# EAGLE schematic thermostat (EAGLE 8.0.0)
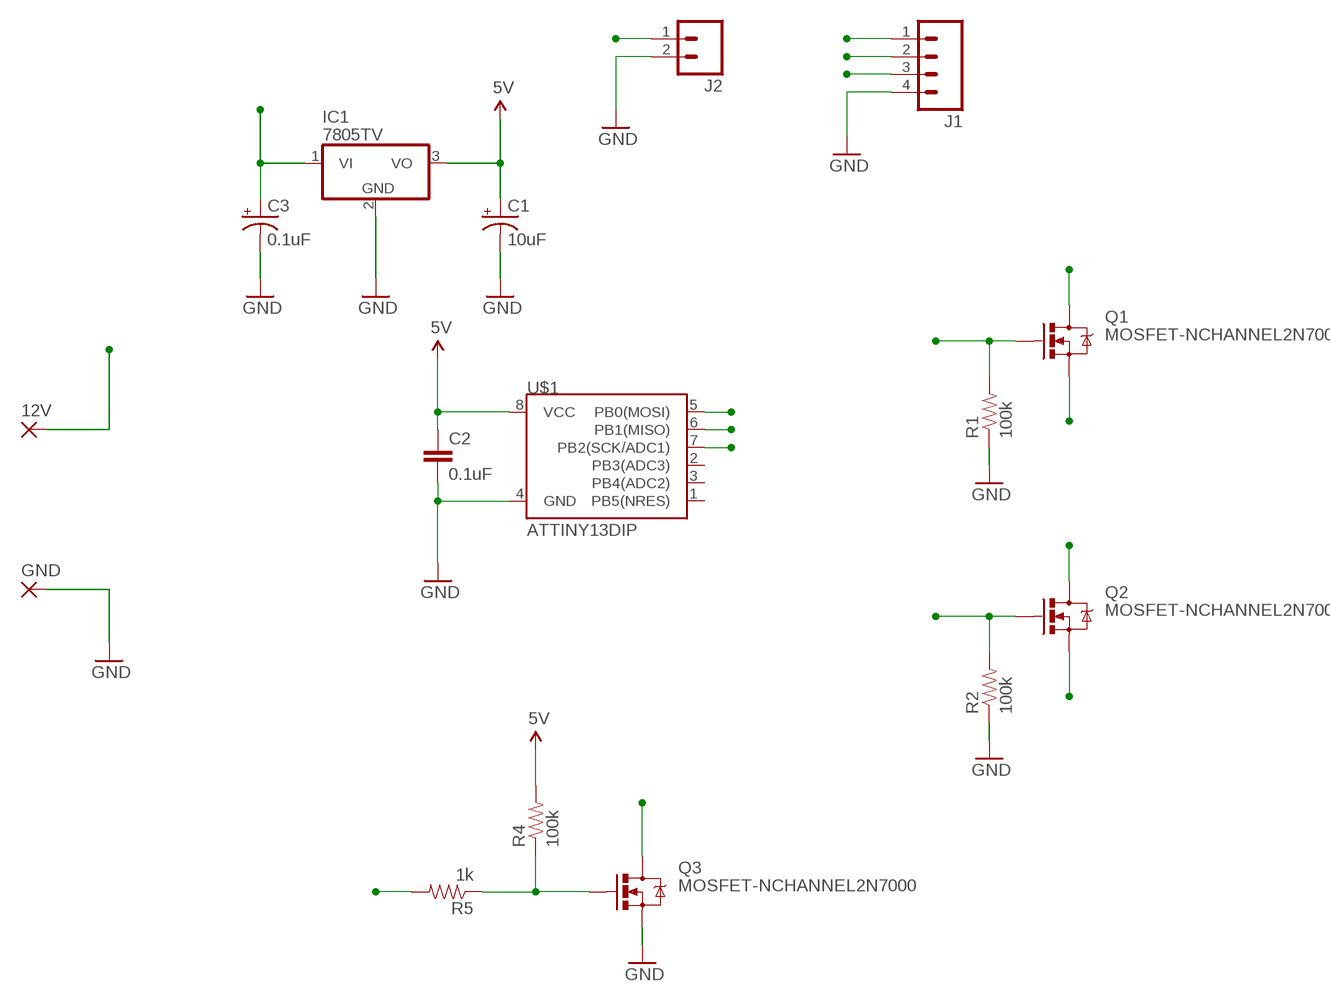
[diagram p0: schematic, sheet 1]

## Parts
12V  WIREPAD2,54/0,8  [2,54/0,8]
C1  10uF  CAP_POLPTH2  [CPOL-RADIAL-10UF-25V]
C2  0.1uF  CAPEZ  [CAP-PTH-SMALLEZ]
C3  0.1uF  CAP_POLPTH2  [CPOL-RADIAL-10UF-25V]
GND  WIREPAD2,54/0,8  [2,54/0,8]
IC1  7805TV  [TO220V]
J1  M04PTH  [1X04]
J2  M02PTH  [1X02]
Q1  MOSFET-NCHANNEL2N7000  [TO-92]
Q2  MOSFET-NCHANNEL2N7000  [TO-92]
Q3  MOSFET-NCHANNEL2N7000  [TO-92]
R1  100k  RESISTORAXIAL-0.3  [AXIAL-0.3]
R2  100k  RESISTORAXIAL-0.3  [AXIAL-0.3]
R4  100k  RESISTORAXIAL-0.3  [AXIAL-0.3]
R5  1k  RESISTORAXIAL-0.3  [AXIAL-0.3]
U$1  ATTINY13DIP  [DIP08]

## Nets
5V: C1.1(+) C2.1 IC1.3(VO) R4.P$2 U$1.8(VCC)
12V: 12V.1(P) C3.1(+) IC1.1(VI)
GND: C1.2(-) C2.2 C3.2(-) GND.1(P) IC1.2(GND) J1.4 J2.2 Q3.1(S) R1.P$1 R2.P$1 U$1.4(GND)
HEAT_OFF: Q2.2(G) R2.P$2 U$1.5(PB0(MOSI))
HEAT_ON: Q1.2(G) R1.P$2 U$1.6(PB1(MISO))
N$1: Q3.2(G) R4.P$1 R5.P$1
SENSOR_IN: Q3.3(D) U$1.7(PB2(SCK/ADC1))
SW_COMMON: J1.3 Q1.3(D) Q2.3(D)
SWITCH_OFF: J1.1 Q2.1(S)
SWITCH_ON: J1.2 Q1.1(S)
THERMOSTAT_IN: J2.1 R5.P$2
Unconnected: U$1.1(PB5(NRES)) U$1.2(PB3(ADC3)) U$1.3(PB4(ADC2))

## Library data of the parts
12V GND = wirepad:WIREPAD: Wire PAD connect wire on PCB
C1 C3 = SparkFun-Capacitors:CAP_POL: Capacitor Polarized These are standard SMD and PTH capacitors. Normally 10uF, 47uF, and 100uF in electrolytic and tantalum varieties. Always verify the external diameter of the through hole cap, it varies with capacity, voltage, and manufacturer. The EIA devices should be standard.
C2 = SparkFun-Capacitors:CAP: Capacitor Standard 0603 ceramic capacitor, and 0.1" leaded capacitor.
IC1 = linear:78*: Positive VOLTAGE REGULATOR Source: http://cache.national.com/ds/LM/LM78L05.pdf http://www.fairchildsemi.com/ds/LM/LM7805.pdf
J1 = SparkFun-Connectors:M04: Header 4 Standard 4-pin 0.1" header. Use with straight break away headers (SKU : PRT-00116), right angle break away headers (PRT-00553), swiss pins (PRT-00743), machine pins (PRT-00117), and female headers (PRT-00115). Molex polarized connector foot print use with SKU : PRT-08231 with associated crimp pins and housings. 1MM SMD Version SKU: PRT-10208; PROD_ID: CONN-09696
J2 = SparkFun-Connectors:M02: Standard 2-pin 0.1" header. Use with - straight break away headers ( PRT-00116) - right angle break away headers (PRT-00553) - swiss pins (PRT-00743) - machine pins (PRT-00117) - female headers (PRT-00115) Molex polarized connector foot print use with: PRT-08233 with associated crimp pins and housings. 2.54_SCREWTERM for use with PRT-10571. 3.5mm Screw Terminal footprints for PRT-08084 5mm Screw Terminal footprints for use with PRT-08432
Q1-Q3 = SparkFun-DiscreteSemi:MOSFET-NCHANNEL: Common NMOSFET Parts MFG P/N Store ID Prod ID FDD8780 TRANS-09984 SI7820DN TRANS-11055 FDS6630A IC-08089 2N7002PW TRANS-11151 FQP30N06L COM-10213 TRANS-10060 BSS123LT1G TRANS-08345 BSS138 TRANS-00830 BS170 2N7000
R1 R2 R4 R5 = SparkFun-Passives:RESISTOR: Resistor Basic schematic elements and footprints for 0603, 1206, and PTH resistors.
U$1 = SparkFun-DigitalIC:ATTINY13: Atmel 8-pin 1kB flash uC